# Altium project ESP_WDK.PrjPcb
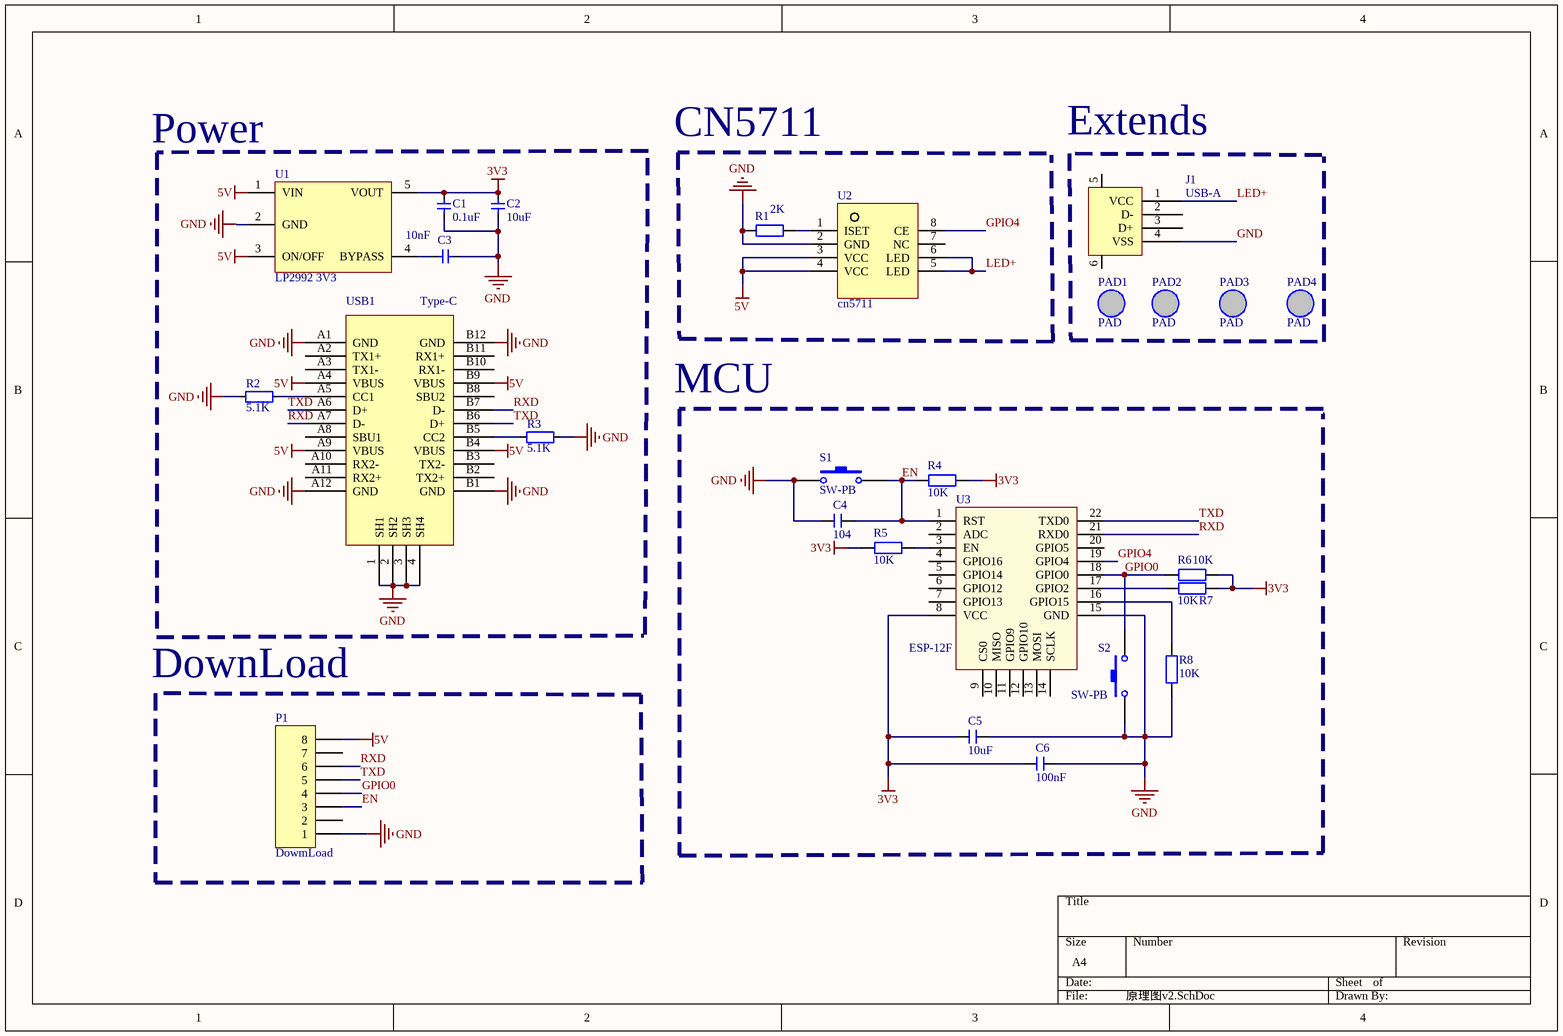
[diagram p0: 原理图v2.SchDoc]
1 sheet, 26 parts. Net scope: global (net labels, ports and power ports of the same name join across sheets).
Board file: WDK-LED.PcbDoc

## Sheet 原理图v2.SchDoc
size A4

### Parts
C1  0.1uF  [CAP_0402]
C2  10uF  [C0805_L]
C3  10nF  [CAP_0402]
C4  104  [CAP_0402]
C5  10uF  [C0805_L]
C6  100nF  [CAP_0402]
J1  USB-A  [USB-A/S_C]
P1  DowmLoad  [FPC0.5 2H-WS-8P]
PAD1  PAD  [M2]
PAD2  PAD  [M2]
PAD3  PAD  [M2]
PAD4  PAD  [M2]
R1  2K  [RES_0402]
R2  5.1K  [RES_0402]
R3  5.1K  [RES_0402]
R4  10K  [RES_0402]
R5  10K  [RES_0402]
R6  10K  [RES_0402]
R7  10K  [RES_0402]
R8  10K  [RES_0402]
S1  SW-PB  [SW SMD-3*6*2.5]
S2  SW-PB  [SW SMD-3*6*2.5]
U1  LP2992 3V3  [SOT23-5]
U2  cn5711  [SOP8]
U3  ESP-12F  [ESP-12F]
USB1  Type-C  [USB-C-SMD_16P]

### Nets
3V3: C1.2 C2.2 C5.1 C6.1 R4.2 R5.1 R6.2 R7.2 U1.5(VOUT) U3.8(VCC)
5V: P1.8 U1.1(VIN) U1.3(ON/OFF) U2.3(VCC) U2.4(VCC) USB1.A4(VBUS) USB1.A9(VBUS) USB1.B4(VBUS) USB1.B9(VBUS)
GND: C1.1 C2.1 C3.1 C4.1 C5.2 C6.2 J1.4(VSS) P1.1 R1.1 R2.1 R3.1 R8.1 S1.1 S2.1 U1.2(GND) U2.2(GND) U3.15(GND) USB1.1(SH1) USB1.2(SH2) USB1.3(SH3) USB1.4(SH4) USB1.A1(GND) USB1.A12(GND) USB1.B1(GND) USB1.B12(GND)
EN: C4.2 P1.3 R4.1 S1.2 U3.1(RST)
GPIO0: P1.4 R6.1 S2.2 U3.18(GPIO0)
GPIO4: U2.8(CE) U3.19(GPIO4)
LED+: J1.1(VCC) U2.5(LED) U2.6(LED)
RXD: P1.6 U3.21(RXD0) USB1.A7(D-) USB1.B7(D-)
TXD: P1.5 U3.22(TXD0) USB1.A6(D+) USB1.B6(D+)
NetC3_2: C3.2 U1.4(BYPASS)
NetR1_2: R1.2 U2.1(ISET)
NetR2_2: R2.2 USB1.A5(CC1)
NetR3_2: R3.2 USB1.B5(CC2)
NetR5_2: R5.2 U3.3(EN)
NetR7_1: R7.1 U3.17(GPIO2)
NetR8_2: R8.2 U3.16(GPIO15)

Not connected (* = marked no-connect by the designer): J1 2(D-) 3(D+) 5 6; P1 2 7; U2 7(NC); U3 2(ADC) 4(GPIO16) 5(GPIO14) 6(GPIO12) 7(GPIO13) 9(CS0) 10(MISO) 11(GPIO9) 12(GPIO10) 13(MOSI) 14(SCLK) 20(GPIO5); USB1 A2(TX1+) A3(TX1-) A8(SBU1) A10(RX2-) A11(RX2+) B2(TX2+) B3(TX2-) B8(SBU2) B10(RX1-) B11(RX1+)

### Notes on the sheet
- (near U1) Power
- CN5711
- (near J1) Extends
- MCU
- (near P1) DownLoad

### Library data of the parts
C1-C3 = 电容-0402: Capacitor; Value: 0.1u
C4-C6 = C: 无极性贴片电容; 版权归属: 源创客; BOM名称: 无极性贴片电容; 学习资源: www.ooocke.com
J1 = USB: USB接口
P1 = Header 8: Header, 8-Pin; LatestRevisionDate: 17-Jul-2002; LatestRevisionNote: Re-released for DXP Platform.; Publisher: Altium Limited
PAD1-PAD4 = PAD: M2通孔
R1 R4-R8 = R: 贴片电阻; 版权归属: 源创客; BOM名称: 贴片电阻; 学习资源: www.ooocke.com
R2 R3 = 电阻-0402: Resistor; Value: 22R
S1 S2 = SW-PB: 微动开关; Published: 24-Mar-1999; LatestRevisionDate: 17-Jul-2002; LatestRevisionNote: Re-released for DXP Platform.; PackageReference: SPST-2; Publisher: Altium Limited
U1 = LP2992: LDO
U3 = ESP-12F: Manufacturer: 安信可; Price: 12.27; Value: ESP-12F
USB1 = USB-Type-C-TOP